# EAGLE design Hank2 (EAGLE 7.7.0)
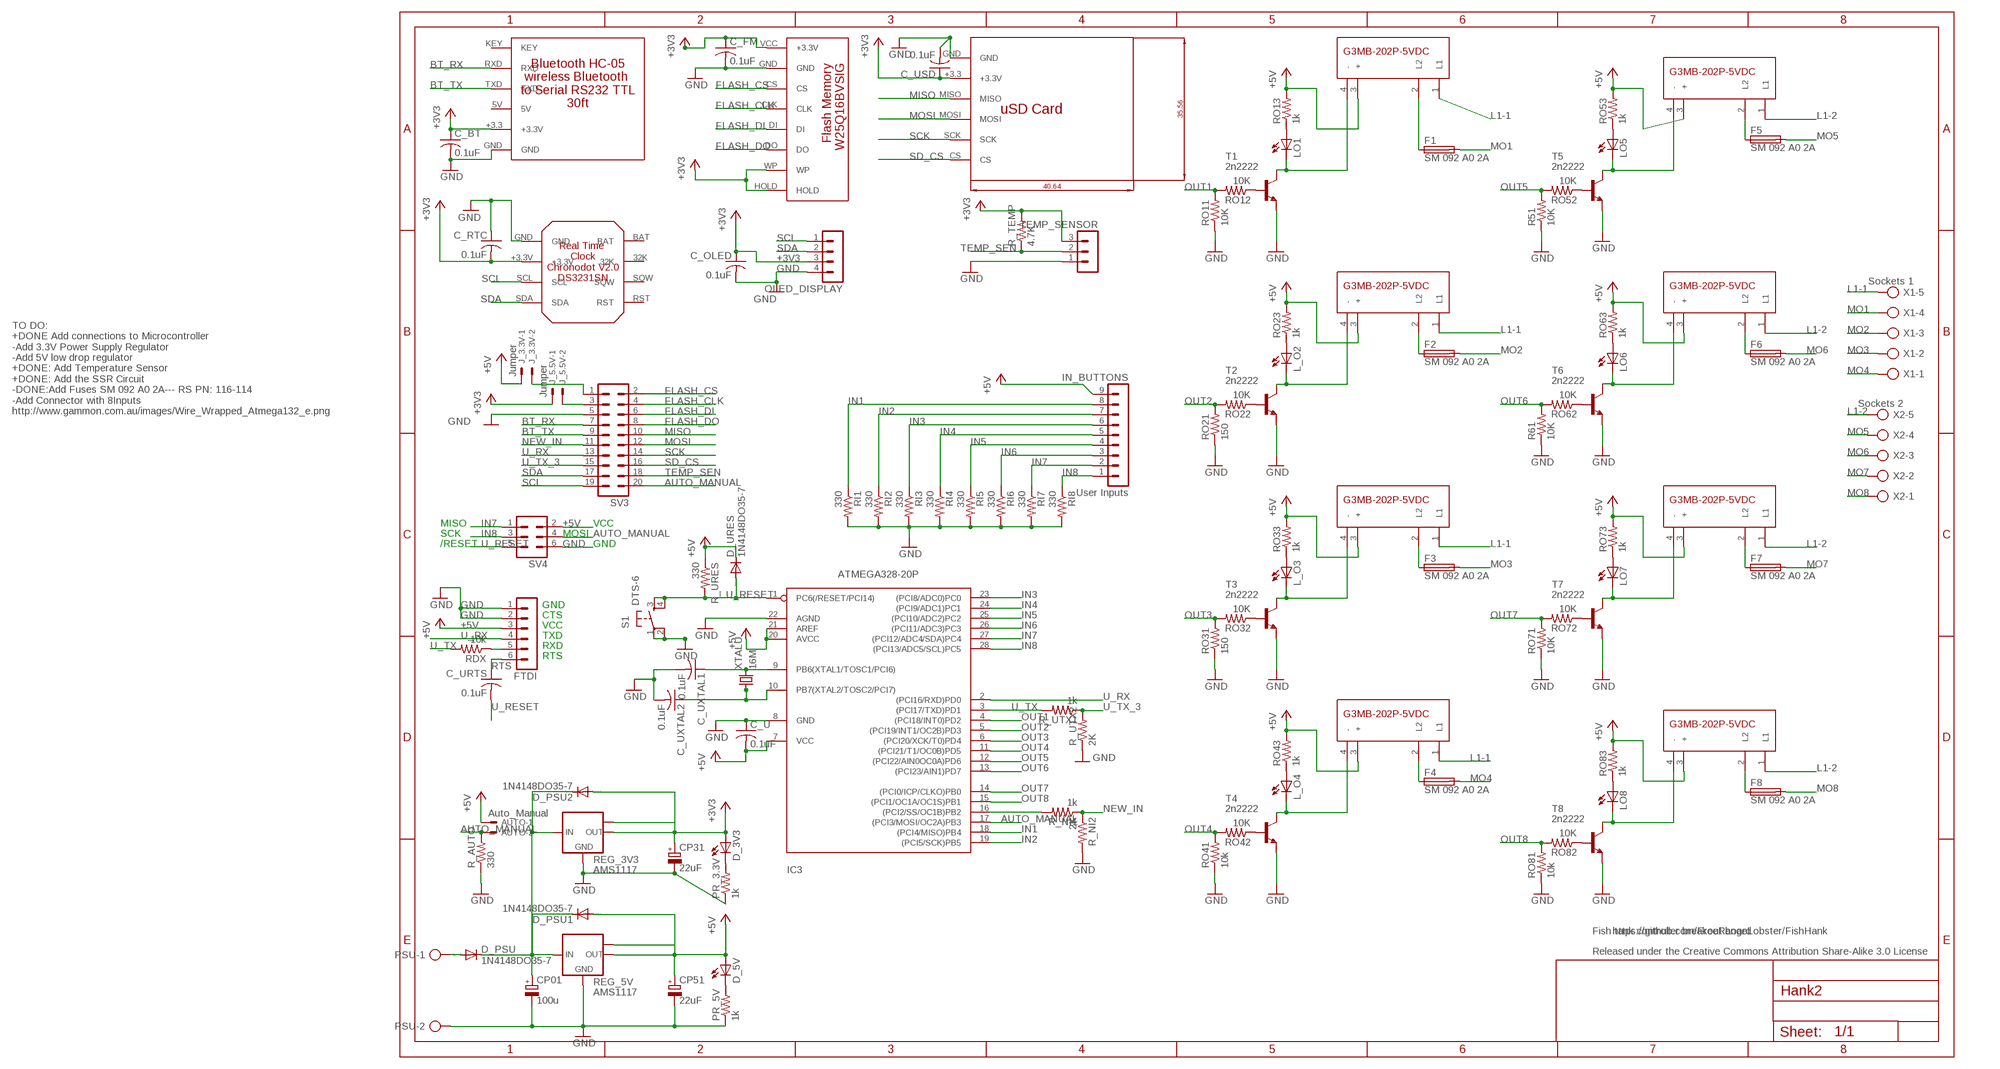
[diagram p0: schematic, sheet 1]

## Parts
AUTO  Auto_Manual  22-23-2021  [22-23-2021]
C_BT  0.1uF  C-US025-024X044  [C025-024X044]
C_FM  0.1uF  C-US025-024X044  [C025-024X044]
C_OLED  0.1uF  C-US025-024X044  [C025-024X044]
C_RTC  0.1uF  C-US025-024X044  [C025-024X044]
C_U  0.1uF  C-US025-024X044  [C025-024X044]
C_URTS  0.1uF  C-US025-024X044  [C025-024X044]
C_USD  0.1uF  C-US025-024X044  [C025-024X044]
C_UXTAL1  0.1uF  C-US025-024X044  [C025-024X044]
C_UXTAL2  0.1uF  C-US025-024X044  [C025-024X044]
CP01  100u  CPOL-EUE2.5-6  [E2,5-6]
CP31  22uF  CPOL-EUE2.5-6  [E2,5-6]
CP51  22uF  CPOL-EUE2.5-6  [E2,5-6]
D_3V3  LED3MM  [LED3MM]
D_5V  LED3MM  [LED3MM]
D_PSU  1N4148DO35-7  [DO35-7]
D_PSU1  1N4148DO35-7  [DO35-7]
D_PSU2  1N4148DO35-7  [DO35-7]
D_URES  1N4148DO35-7  [DO35-7]
F1  SM 092 A0 2A  FUSEPICOFUSE  [PICOFUSE]
F2  SM 092 A0 2A  FUSEPICOFUSE  [PICOFUSE]
F3  SM 092 A0 2A  FUSEPICOFUSE  [PICOFUSE]
F4  SM 092 A0 2A  FUSEPICOFUSE  [PICOFUSE]
F5  SM 092 A0 2A  FUSEPICOFUSE  [PICOFUSE]
F6  SM 092 A0 2A  FUSEPICOFUSE  [PICOFUSE]
F7  SM 092 A0 2A  FUSEPICOFUSE  [PICOFUSE]
F8  SM 092 A0 2A  FUSEPICOFUSE  [PICOFUSE]
FTDI  MA06-1  [MA06-1]
IC3  ATMEGA328-20P  [DIL28-3]
IN_BUTTONS  User Inputs  MA09-1  [MA09-1]
J_3.3V  Jumper  22-23-2021  [22-23-2021]
J_5.5V  Jumper  22-23-2021  [22-23-2021]
L_O2  LED3MM  [LED3MM]
L_O3  LED3MM  [LED3MM]
L_O4  LED3MM  [LED3MM]
LO1  LED3MM  [LED3MM]
LO5  LED3MM  [LED3MM]
LO6  LED3MM  [LED3MM]
LO7  LED3MM  [LED3MM]
LO8  LED3MM  [LED3MM]
OLED_DISPLAY  MA04-1  [MA04-1]
PR_3.3V  1k  R-US_0207/10  [0207/10]
PR_5V  1k  R-US_0207/10  [0207/10]
PSU  AK500/2  [AK500/2]
R51  10K  R-US_0207/10  [0207/10]
R61  10K  R-US_0207/10  [0207/10]
R_AUTO  330  R-US_0207/10  [0207/10]
R_NI1  1k  R-US_0207/10  [0207/10]
R_NI2  2K  R-US_0207/10  [0207/10]
R_TEMP  4.7K  R-US_0207/10  [0207/10]
R_URES  330  R-US_0207/10  [0207/10]
R_UTX1  1k  R-US_0207/10  [0207/10]
R_UTX2  2K  R-US_0207/10  [0207/10]
RDX  10k  R-US_0207/10  [0207/10]
REG_3V3  AMS1117  [SOT223]
REG_5V  AMS1117  [SOT223]
RI1  330  R-US_0207/10  [0207/10]
RI2  330  R-US_0207/10  [0207/10]
RI3  330  R-US_0207/10  [0207/10]
RI4  330  R-US_0207/10  [0207/10]
RI5  330  R-US_0207/10  [0207/10]
RI6  330  R-US_0207/10  [0207/10]
RI7  330  R-US_0207/10  [0207/10]
RI8  330  R-US_0207/10  [0207/10]
RO11  10K  R-US_0207/10  [0207/10]
RO12  10K  R-US_0207/10  [0207/10]
RO13  1k  R-US_0207/10  [0207/10]
RO21  150  R-US_0207/10  [0207/10]
RO22  10K  R-US_0207/10  [0207/10]
RO23  1k  R-US_0207/10  [0207/10]
RO31  150  R-US_0207/10  [0207/10]
RO32  10K  R-US_0207/10  [0207/10]
RO33  1k  R-US_0207/10  [0207/10]
RO41  10k  R-US_0207/10  [0207/10]
RO42  10K  R-US_0207/10  [0207/10]
RO43  1k  R-US_0207/10  [0207/10]
RO52  10K  R-US_0207/10  [0207/10]
RO53  1k  R-US_0207/10  [0207/10]
RO62  10K  R-US_0207/10  [0207/10]
RO63  1k  R-US_0207/10  [0207/10]
RO71  10K  R-US_0207/10  [0207/10]
RO72  10K  R-US_0207/10  [0207/10]
RO73  1k  R-US_0207/10  [0207/10]
RO81  10k  R-US_0207/10  [0207/10]
RO82  10K  R-US_0207/10  [0207/10]
RO83  1k  R-US_0207/10  [0207/10]
S1  DTS-6  [DTS-6]
SSR1  SSR  [SSR_FOOTPRINT]
SSR2  SSR  [SSR_FOOTPRINT]
SSR3  SSR  [SSR_FOOTPRINT]
SSR4  SSR  [SSR_FOOTPRINT]
SSR5  SSR  [SSR_FOOTPRINT]
SSR6  SSR  [SSR_FOOTPRINT]
SSR7  SSR  [SSR_FOOTPRINT]
SSR8  SSR  [SSR_FOOTPRINT]
SV3  MA10-2  [MA10-2]
SV4  MA03-2  [MA03-2]
T1  2n2222  2SC458  [TO92-ECB]
T2  2n2222  2SC458  [TO92-ECB]
T3  2n2222  2SC458  [TO92-ECB]
T4  2n2222  2SC458  [TO92-ECB]
T5  2n2222  2SC458  [TO92-ECB]
T6  2n2222  2SC458  [TO92-ECB]
T7  2n2222  2SC458  [TO92-ECB]
T8  2n2222  2SC458  [TO92-ECB]
TEMP_SENSOR  MA03-1  [MA03-1]
U$1  FLASH_MEMORY  [FLASHMEMORY_FOOTPRINT]
U$4  BLUETOOTH  [BLUETOOTH_FOOTPRINT]
U$6  RTC  [RTC_FOOTPRINT]
U$7  SD_CARD_READER  [SD_CARD_READER_FOOTPRINT]
X1  Sockets 1  AK500/5  [AK500/5]
X2  Sockets 2  AK500/5  [AK500/5]
XTALU  16M  CRYSTALHC49S  [HC49/S]

## Nets
+3V3: C_BT.1 C_FM.1 C_OLED.1 C_RTC.2 C_USD.1 CP31.+ D_3V3.A D_PSU2.A J_5.5V.1 OLED_DISPLAY.3 R_TEMP.2 REG_3V3.2(OUT) REG_3V3.TAB(OUT1) TEMP_SENSOR.3 U$1.HOLD U$1.VCC(+3.3V) U$1.WP U$4.+3.3(+3.3V) U$6.+3.3V U$7.+3.3(+3.3V)
+5V: AUTO.1 C_U.2 CP51.+ D_5V.A D_PSU1.A D_URES.C FTDI.3 IC3.7(VCC) IC3.20(AVCC) IC3.21(AREF) IN_BUTTONS.9 J_3.3V.1 R_URES.1 REG_5V.2(OUT) REG_5V.TAB(OUT1) RO13.2 RO23.2 RO33.2 RO43.2 RO53.2 RO63.2 RO73.2 RO83.2 SSR1.3(+) SSR2.3(+) SSR3.3(+) SSR4.3(+) SSR5.3(+) SSR6.3(+) SSR7.3(+) SSR8.3(+) SV4.2
AUTO_MANUAL: AUTO.2 IC3.17((PCI3/MOSI/OC2A)PB3) R_AUTO.2 SV3.20 SV4.4
BT_RX: SV3.7 U$4.RXD
BT_TX: SV3.9 U$4.TXD
CP12: CP01.+ D_PSU1.C D_PSU2.C D_PSU.C REG_3V3.3(IN) REG_5V.3(IN)
FLASH_CLK: SV3.4 U$1.CLK
FLASH_CS: SV3.2 U$1.CS
FLASH_DI: SV3.6 U$1.DI
FLASH_DO: SV3.8 U$1.DO
GND [vcc]: C_BT.2 C_FM.2 C_OLED.2 C_RTC.1 C_U.1 C_USD.2 C_UXTAL1.2 C_UXTAL2.2 CP01.- CP31.- CP51.- FTDI.1 FTDI.2 IC3.8(GND) IC3.22(AGND) OLED_DISPLAY.4 PR_3.3V.1 PR_5V.1 PSU.2 R51.1 R61.1 R_AUTO.1 R_NI2.2 R_UTX2.1 REG_3V3.1(GND) REG_5V.1(GND) RI1.2 RI2.2 RI3.2 RI4.2 RI5.2 RI6.2 RI7.2 RI8.2 RO11.1 RO21.1 RO31.1 RO41.1 RO71.1 RO81.1 S1.1 S1.2 SV3.5 SV4.6 T1.E T2.E T3.E T4.E T5.E T6.E T7.E T8.E TEMP_SENSOR.1 U$1.GND U$4.GND U$6.GND U$7.GND
IN1: IC3.18((PCI4/MISO)PB4) IN_BUTTONS.8 RI1.1
IN2: IC3.19((PCI5/SCK)PB5) IN_BUTTONS.7 RI2.1
IN3: IC3.23((PCI8/ADC0)PC0) IN_BUTTONS.6 RI3.1
IN4: IC3.24((PCI9/ADC1)PC1) IN_BUTTONS.5 RI4.1
IN5: IC3.25((PCI10/ADC2)PC2) IN_BUTTONS.4 RI5.1
IN6: IC3.26((PCI11/ADC3)PC3) IN_BUTTONS.3 RI6.1
IN7: IC3.27((PCI12/ADC4/SDA)PC4) IN_BUTTONS.2 RI7.1 SV4.1
IN8: IC3.28((PCI13/ADC5/SCL)PC5) IN_BUTTONS.1 RI8.1 SV4.3
L1-1: SSR1.1(L1) SSR2.1(L1) SSR3.1(L1) SSR4.1(L1) X1.5
L1-2: SSR5.1(L1) SSR6.1(L1) SSR7.1(L1) SSR8.1(L1) X2.5
L_O1: L_O2.K(C) SSR2.4(-) T2.C
L_O3: L_O3.K(C) SSR3.4(-) T3.C
MISO: SV3.10 U$7.MISO
MO1: F1.2 X1.4
MO2: F2.2 X1.3
MO3: F3.2 X1.2
MO4: F4.2 X1.1
MO5: F5.2 X2.4
MO6: F6.2 X2.3
MO7: F7.2 X2.2
MO8: F8.2 X2.1
MOSI: SV3.12 U$7.MOSI
N$1: J_3.3V.2 SV3.1
N$2: J_5.5V.2 SV3.3
N$3: F1.1 SSR1.2(L2)
N$4: D_5V.K(C) PR_5V.2
N$5: D_3V3.K(C) PR_3.3V.2
N$7: D_PSU.A PSU.1
N$8: RO12.1 T1.B
N$9: RO52.1 T5.B
N$10: F8.1 SSR8.2(L2)
N$11: LO5.A RO53.1
N$12: LO5.K(C) SSR5.4(-) T5.C
N$13: F7.1 SSR7.2(L2)
N$14: F2.1 SSR2.2(L2)
N$15: F3.1 SSR3.2(L2)
N$16: LO6.A RO63.1
N$17: LO6.K(C) SSR6.4(-) T6.C
N$18: RO62.1 T6.B
N$19: F6.1 SSR6.2(L2)
N$20: LO7.A RO73.1
N$21: LO7.K(C) SSR7.4(-) T7.C
N$22: RO72.1 T7.B
N$23: RO42.1 T4.B
N$24: F4.1 SSR4.2(L2)
N$25: LO8.A RO83.1
N$26: LO8.K(C) SSR8.4(-) T8.C
N$27: RO32.1 T3.B
N$28: F5.1 SSR5.2(L2)
N$29: LO1.A RO13.1
N$30: LO1.K(C) SSR1.4(-) T1.C
N$31: RO22.1 T2.B
N$32: C_UXTAL1.1 IC3.9(PB6(XTAL1/TOSC1/PCI6)) XTALU.2
N$33: L_O2.A RO23.1
N$34: RO82.1 T8.B
N$35: C_UXTAL2.1 IC3.10(PB7(XTAL2/TOSC2/PCI7)) XTALU.1
N$37: L_O3.A RO33.1
N$39: IC3.16((PCI2/SS/OC1B)PB2) R_NI1.2
N$41: L_O4.A RO43.1
N$42: L_O4.K(C) SSR4.4(-) T4.C
NEW_IN: R_NI1.1 R_NI2.1 SV3.11
OUT1: IC3.4((PCI18/INT0)PD2) RO11.2 RO12.2
OUT2: IC3.5((PCI19/INT1/OC2B)PD3) RO21.2 RO22.2
OUT3: IC3.6((PCI20/XCK/T0)PD4) RO31.2 RO32.2
OUT4: IC3.11((PCI21/T1/OC0B)PD5) RO41.2 RO42.2
OUT5: IC3.12((PCI22/AIN0OC0A)PD6) R51.2 RO52.2
OUT6: IC3.13((PCI23/AIN1)PD7) R61.2 RO62.2
OUT7: IC3.14((PCI0/ICP/CLKO)PB0) RO71.2 RO72.2
OUT8: IC3.15((PCI1/OC1A/OC1S)PB1) RO81.2 RO82.2
RTS: C_URTS.1 FTDI.6
SCK: SV3.14 U$7.SCK
SCL: OLED_DISPLAY.1 SV3.19 U$6.SCL
SD_CS: SV3.16 U$7.CS
SDA: OLED_DISPLAY.2 SV3.17 U$6.SDA
TEMP_SEN: R_TEMP.1 SV3.18 TEMP_SENSOR.2
U_RESET: C_URTS.2 D_URES.A IC3.1(PC6(/RESET/PCI14)) R_URES.2 S1.3 S1.4 SV4.5
U_RX: FTDI.4 IC3.2((PCI16/RXD)PD0) SV3.13
U_TX: IC3.3((PCI17/TXD)PD1) R_UTX1.2 RDX.2
U_TX_3: R_UTX1.1 R_UTX2.2 SV3.15
UTX: FTDI.5 RDX.1
Unconnected: U$4.5V U$4.KEY U$6.32K U$6.BAT U$6.RST U$6.SQW

## Notes on the sheet
- TO DO:
  +DONE Add connections to Microcontroller
  -Add 3.3V Power Supply Regulator
  -Add 5V low drop regulator
  +DONE: Add Temperature Sensor
  +DONE: Add the SSR Circuit
  -DONE:Add Fuses SM 092 A0 2A--- RS PN: 116-114
  -Add Connector with 8Inputs
  http://www.gammon.com.au/images/Wire_Wrapped_Atmega132_e.png
- MISO | VCC
- SCK | MOSI
- /RESET | GND
- GND
- CTS
- VCC
- TXD
- RXD
- RTS
- Fish tank controller breakout board | https://github.com/FreeRangeLobster/FishHank
- Released under the Creative Commons Attribution Share-Alike 3.0 License

## Library data of the parts
AUTO J_3.3V J_5.5V = con-molex:22-23-2021: .100" (2.54mm) Center Header - 2 Pin; MF: MOLEX; MPN: 22-23-2021; OC_FARNELL: 1462926; OC_NEWARK: 25C3832
C_BT C_FM C_OLED C_RTC C_U C_URTS C_USD C_UXTAL1 C_UXTAL2 = rcl:C-US: CAPACITOR, American symbol
CP01 CP31 CP51 = rcl:CPOL-EU: POLARIZED CAPACITOR, European symbol
D_3V3 D_5V L_O2-L_O4 LO1 LO5-LO8 = led:LED: LED OSRAM: - CHIPLED LG R971, LG N971, LY N971, LG Q971, LY Q971, LO R971, LY R971 LH N974, LH R974 LS Q976, LO Q976, LY Q976 LO Q996 - Hyper CHIPLED LW Q18S LB Q993, LB Q99A, LB R99A - SideLED LS A670, LO A670, LY A670, LG A670, LP A670 LB A673, LV A673, LT A673, LW A673 LH A674 LY A675 LS A676, LA A676, LO A676, LY A676, LW A676 LS A679, LY A679, LG A679 - Hyper Micro SIDELED® LS Y876, LA Y876, LO Y876, LY Y876 LT Y87S - SmartLED LW L88C, LW L88S LB L89C, LB L89S, LG L890 LS L89K, LO L89K, LY L89K LS L896, LA L896, LO L896, LY L896 - TOPLED LS T670, LO T670, LY T670, LG T670, LP T670 LSG T670, LSP T670, LSY T670, LOP T670, LYG T670 LG T671, LOG T671, LSG T671 LB T673, LV T673, LT T673, LW T673 LH T674 LS T676, LA T676, LO T676, LY T676, LB T676, LH T676, LSB T676, LW T676 LB T67C, LV T67C, LT T67C, LS T67K, LO T67K, LY T67K, LW E67C LS E67B, LA E67B, LO E67B, LY E67B, LB E67C, LV E67C, LT E67C LW T67C LS T679, LY T679, LG T679 LS T770, LO T770, LY T770, LG T770, LP T770 LB T773, LV T773, LT T773, LW T773 LH T774 LS E675, LA E675, LY E675, LS T675 LS T776, LA T776, LO T776, LY T776, LB T776 LHGB T686 LT T68C, LB T68C - Hyper Mini TOPLED® LB M676 - Mini TOPLED Santana® LG M470 LS M47K, LO M47K, LY M47K Source: http://www.osram.convergy.de LUXEON: - LUMILED® LXK2-PW12-R00, LXK2-PW12-S00, LXK2-PW14-U00, LXK2-PW14-V00 LXK2-PM12-R00, LXK2-PM12-S00, LXK2-PM14-U00 LXK2-PE12-Q00, LXK2-PE12-R00, LXK2-PE12-S00, LXK2-PE14-T00, LXK2-PE14-U00 LXK2-PB12-K00, LXK2-PB12-L00, LXK2-PB12-M00, LXK2-PB14-N00, LXK2-PB14-P00, LXK2-PB14-Q00 LXK2-PR12-L00, LXK2-PR12-M00, LXK2-PR14-Q00, LXK2-PR14-R00 LXK2-PD12-Q00, LXK2-PD12-R00, LXK2-PD12-S00 LXK2-PH12-R00, LXK2-PH12-S00 LXK2-PL12-P00, LXK2-PL12-Q00, LXK2-PL12-R00 Source: www.luxeon.com KINGBRIGHT: KA-3528ASYC Source: www.kingbright.com
D_PSU D_PSU1 D_PSU2 D_URES = diode:1N4148: DIODE high speed (Philips)
F1-F8 = fuse:FUSE: Fuse; OC_FARNELL: unknown; OC_NEWARK: unknown
FTDI = con-lstb:MA06-1: PIN HEADER; OC_FARNELL: unknown; OC_NEWARK: unknown
IC3 = atmega328:ATMEGA328*P: MICROCONTROLLER 32 kBytes FLASH 2 kBytes SRAM 1 kBytes EEPROM USART 8-channel 10 bit ADC
IN_BUTTONS = con-lstb:MA09-1: PIN HEADER; OC_FARNELL: unknown; OC_NEWARK: unknown
OLED_DISPLAY = con-lstb:MA04-1: PIN HEADER; OC_FARNELL: unknown; OC_NEWARK: unknown
PR_3.3V PR_5V R51 R61 R_AUTO R_NI1 R_NI2 R_TEMP R_URES R_UTX1 R_UTX2 RDX RI1-RI8 RO11-RO13 RO21-RO23 RO31-RO33 RO41-RO43 RO52 RO53 RO62 RO63 RO71-RO73 RO81-RO83 = rcl:R-US_: RESISTOR, American symbol
PSU = con-ptr500:AK500/2: CONNECTOR; OC_FARNELL: unknown; OC_NEWARK: unknown
REG_3V3 REG_5V = AMS117:AMS1117
S1 = switch-tact:DTS-6
SSR1-SSR8 = HankLibraries:SSR
SV3 = con-lstb:MA10-2: PIN HEADER; OC_FARNELL: unknown; OC_NEWARK: unknown
SV4 = con-lstb:MA03-2: PIN HEADER; OC_FARNELL: unknown; OC_NEWARK: unknown
T1-T8 = transistor:2SC458: NPN Silicon Epitaxial Planar Transistor Source: SEMTECH ELECTRONICS LTD. ... 2SC458 1.pdf
TEMP_SENSOR = con-lstb:MA03-1: PIN HEADER; OC_FARNELL: unknown; OC_NEWARK: unknown
U$1 = HankLibraries:FLASH_MEMORY
U$4 = HankLibraries:BLUETOOTH
U$6 = HankLibraries:RTC: Real Time Clock PCB Using DS3231SN. Developed by JVivas
U$7 = HankLibraries:SD_CARD_READER
X1 X2 = con-ptr500:AK500/5: CONNECTOR; OC_FARNELL: unknown; OC_NEWARK: unknown
XTALU = crystal:CRYSTAL: CRYSTAL; OC_FARNELL: 1667008; OC_NEWARK: unknown

## Net classes
1 vcc: width 0.508 mm

## Board
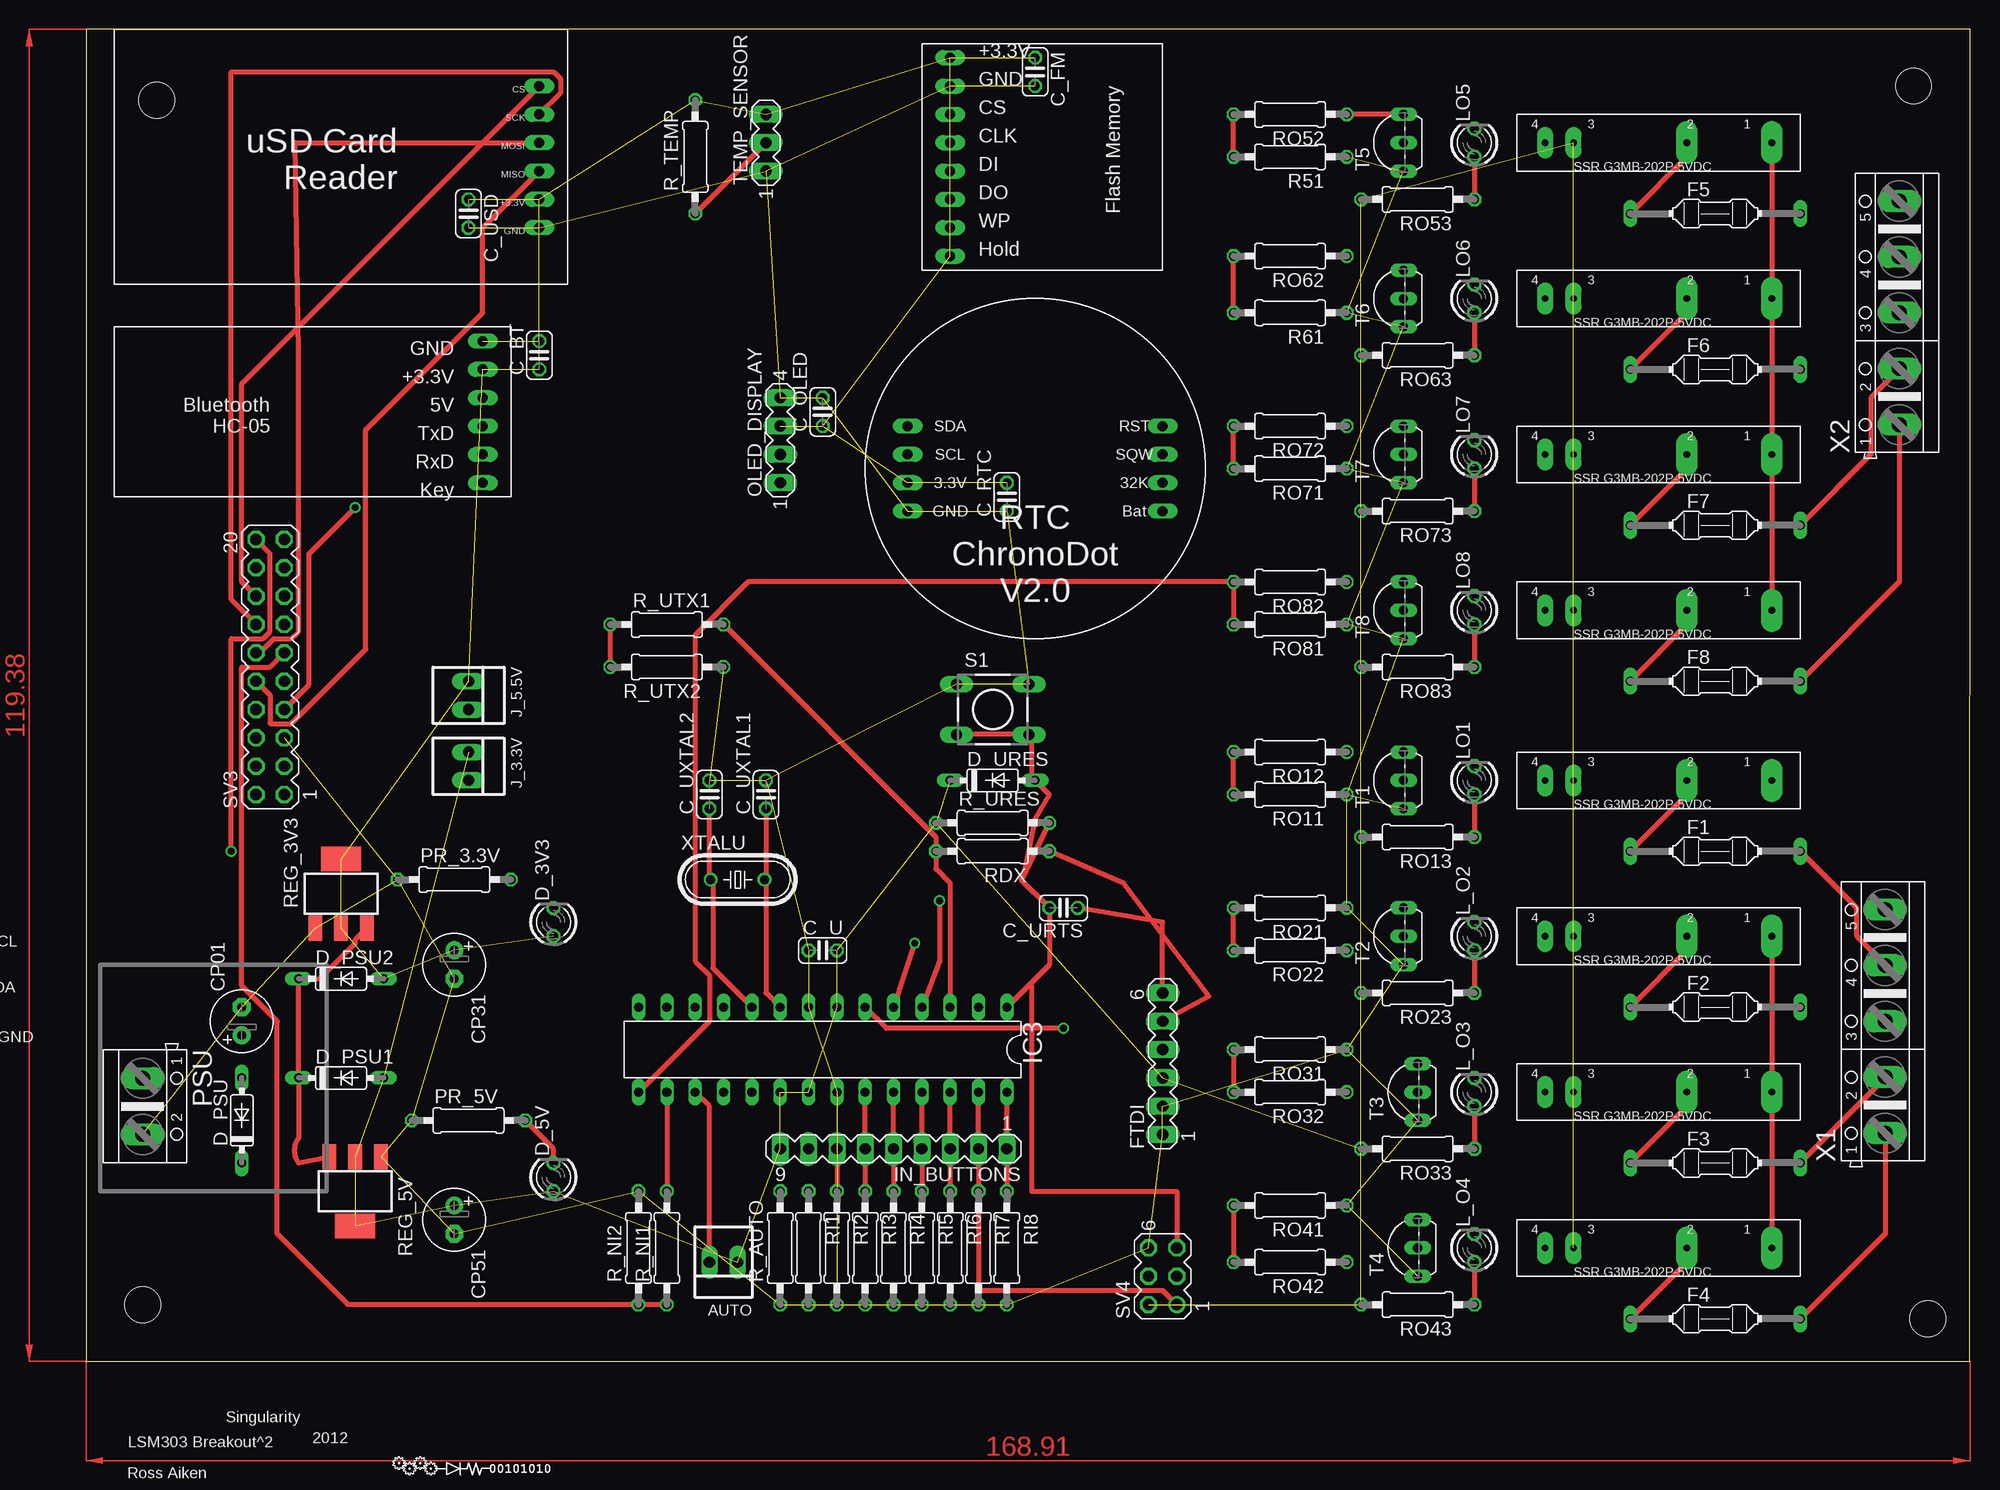
[diagram p1: board, top side]
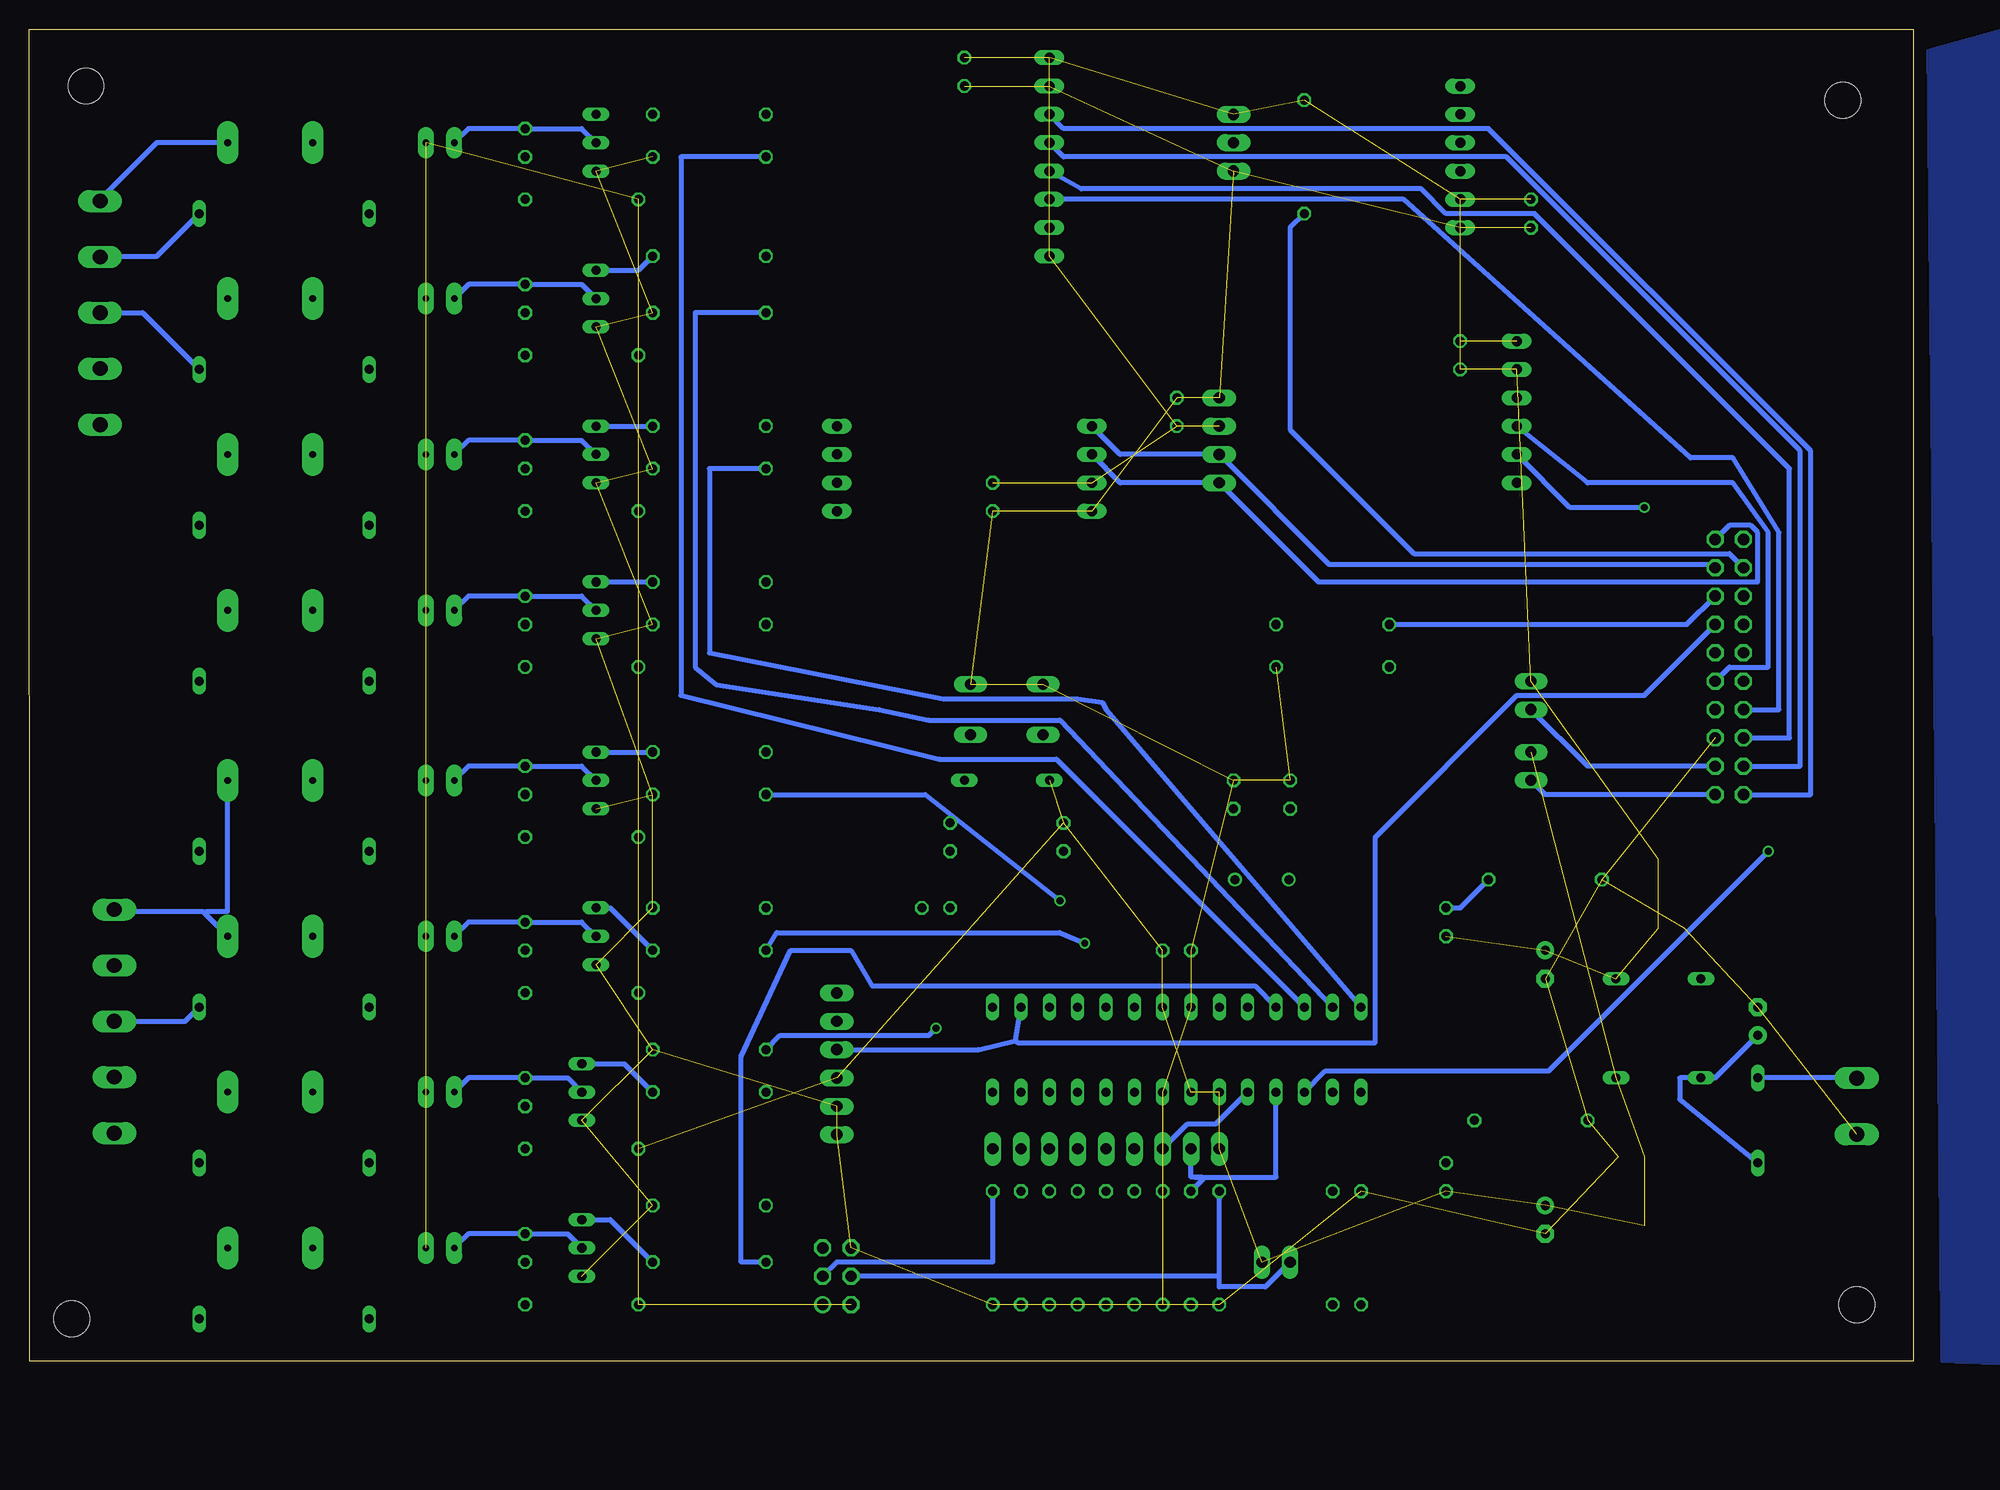
[diagram p2: board, bottom side, seen from below]

Size 168.91 x 119.38 mm. Coordinates in mm from the lower left corner, seen from the top.
Outline: 0,0 168.89,0 168.91,119.38 0,119.38 0,0
Copper layers (1*16): Top 0.0356mm / dielectric 1.5011mm / Bottom 0.0356mm
Design rules "default *": minimum track width 18mil, minimum drill 24mil, track to track 8mil, track to pad 8mil, pad to pad 8mil, via to via 8mil, smd to smd 0mil, copper to edge 40mil, drill to drill 8mil, minimum pad ring 7mil, minimum via ring 7mil, stop-mask expansion 4mil, vias tented up to drill 0mil, thermal gap 10mil
Holes 3.2 mm at 5.08,5.08 6.35,113.03 163.83,114.3 165.1,3.81

### Footprints (pad centres in the part's own frame; a part is rotated, then mirrored left to right if it is on the bottom)
22-23-2021 = drill 1 long: 1 -1.27,0; 2 1.27,0
C025-024X044 = drill 0.813 octagon: 1 -1.27,0; 2 1.27,0
E2,5-6 = drill 0.813 pad 1.6: + -1.27,0 | drill 0.813 pad 1.6 octagon: - 1.27,0
LED3MM = drill 0.813 octagon: A -1.27,0; K 1.27,0
DO35-7 = drill 0.813 long: A 3.81,0; C -3.81,0
PICOFUSE = drill 0.813 long: 1 -7.62,0; 2 7.62,0
MA06-1 = drill 1.016 long: 1 -6.35,0; 2 -3.81,0; 3 -1.27,0; 4 1.27,0; 5 3.81,0; 6 6.35,0
DIL28-3 = drill 0.813 long: 1 -16.51,-3.81; 2 -13.97,-3.81; 3 -11.43,-3.81; 4 -8.89,-3.81; 5 -6.35,-3.81; 6 -3.81,-3.81; 7 -1.27,-3.81; 8 1.27,-3.81; 9 3.81,-3.81; 10 6.35,-3.81; 11 8.89,-3.81; 12 11.43,-3.81; 13 13.97,-3.81; 14 16.51,-3.81; 15 16.51,3.81; 16 13.97,3.81; 17 11.43,3.81; 18 8.89,3.81; 19 6.35,3.81; 20 3.81,3.81; 21 1.27,3.81; 22 -1.27,3.81; 23 -3.81,3.81; 24 -6.35,3.81; 25 -8.89,3.81; 26 -11.43,3.81; 27 -13.97,3.81; 28 -16.51,3.81
MA09-1 = drill 1.016 long: 1 -10.16,0; 2 -7.62,0; 3 -5.08,0; 4 -2.54,0; 5 0,0; 6 2.54,0; 7 5.08,0; 8 7.62,0; 9 10.16,0
MA04-1 = drill 1.016 long: 1 -3.81,0; 2 -1.27,0; 3 1.27,0; 4 3.81,0
0207/10 = drill 0.813 octagon: 1 -5.08,0; 2 5.08,0
AK500/2 = drill 1.321 long: 1 -2.515,0; 2 2.515,0
SOT223 = smd 1.219 x 2.235: 1 -2.311,-3.099; 2 0,-3.099; 3 2.311,-3.099 | smd 3.6 x 2.2: TAB 0,3.099
DTS-6 = drill 1 long: 1 -3.25,2.25; 2 3.25,2.25; 3 -3.25,-2.25; 4 3.25,-2.25
SSR_FOOTPRINT = drill 0.6 pad 1.93 long: 1 10.16,0; 2 2.54,0 | drill 0.6 pad 1.422 long: 3 -7.62,0; 4 -10.16,0
MA10-2 = drill 1.016 octagon: 1 -11.43,-1.27; 2 -11.43,1.27; 3 -8.89,-1.27; 4 -8.89,1.27; 5 -6.35,-1.27; 6 -6.35,1.27; 7 -3.81,-1.27; 8 -3.81,1.27; 9 -1.27,-1.27; 10 -1.27,1.27; 11 1.27,-1.27; 12 1.27,1.27; 13 3.81,-1.27; 14 3.81,1.27; 15 6.35,-1.27; 16 6.35,1.27; 17 8.89,-1.27; 18 8.89,1.27; 19 11.43,-1.27; 20 11.43,1.27
MA03-2 = drill 1.016: 1 -2.54,-1.27 | drill 1.016 octagon: 2 -2.54,1.27; 3 0,-1.27; 4 0,1.27; 5 2.54,-1.27; 6 2.54,1.27
TO92-ECB = drill 0.813 long: B 2.54,0; C 0,0; E -2.54,0
MA03-1 = drill 1.016 long: 1 -2.54,0; 2 0,0; 3 2.54,0
FLASHMEMORY_FOOTPRINT = drill 0.9 long: CLK -8.89,1.27; CS -8.89,3.81; DI -8.89,-1.27; DO -8.89,-3.81; GND -8.89,6.35; HOLD -8.89,-8.89; VCC -8.89,8.89; WP -8.89,-6.35
BLUETOOTH_FOOTPRINT = drill 0.9 long: 5V -15.24,-1.27; +3.3 -15.24,-3.81; GND -15.24,-6.35; KEY -15.24,6.35; RXD -15.24,3.81; TXD -15.24,1.27
RTC_FOOTPRINT = drill 0.9 long: 32K -11.43,0; +3.3V 11.43,0; BAT -11.43,2.54; GND 11.43,2.54; RST -11.43,-5.08; SCL 11.43,-2.54; SDA 11.43,-5.08; SQW -11.43,-2.54
SD_CARD_READER_FOOTPRINT = drill 0.9 long: +3.3 -17.78,3.81; CS -17.78,-6.35; GND -17.78,6.35; MISO -17.78,1.27; MOSI -17.78,-1.27; SCK -17.78,-3.81
AK500/5 = drill 1.321 long: 1 -10.033,0; 2 -5.004,0; 3 0,0; 4 5.004,0; 5 10.008,0
HC49/S = drill 0.813: 1 -2.413,0; 2 2.413,0

### Placement (x,y rotation side)
AUTO  57.15,8.89 180 top
C_BT  40.64,90.17 90 top
C_FM  85.09,115.57 270 top
C_OLED  66.04,85.09 90 top
C_RTC  82.55,77.47 90 top
C_U  66.04,36.83 0 top
C_URTS  87.63,40.64 180 top
C_USD  34.29,102.87 270 top
C_UXTAL1  60.96,50.8 90 top
C_UXTAL2  55.88,50.8 90 top
CP01  13.97,30.48 90 top
CP31  33.02,35.56 270 top
CP51  33.02,12.7 270 top
D_3V3  41.91,39.37 90 top
D_5V  41.91,16.51 90 top
D_PSU  13.97,21.59 90 top
D_PSU1  22.86,25.4 0 top
D_PSU2  22.86,34.29 0 top
D_URES  81.28,52.07 0 top
F1  146.05,45.72 0 top
F2  146.05,31.75 0 top
F3  146.05,17.78 0 top
F4  146.05,3.81 0 top
F5  146.05,102.87 0 top
F6  146.05,88.9 0 top
F7  146.05,74.93 0 top
F8  146.05,60.96 0 top
FTDI  96.52,26.67 90 top
IC3  66.04,27.94 180 top
IN_BUTTONS  72.39,19.05 180 top
J_3.3V  34.29,53.34 270 top
J_5.5V  34.29,59.69 270 top
L_O2  124.46,38.1 90 top
L_O3  124.46,24.13 90 top
L_O4  124.46,10.16 90 top
LO1  124.46,52.07 90 top
LO5  124.46,109.22 90 top
LO6  124.46,95.25 90 top
LO7  124.46,81.28 90 top
LO8  124.46,67.31 90 top
OLED_DISPLAY  62.23,82.55 90 top
PR_3.3V  33.02,43.18 0 top
PR_5V  34.29,21.59 0 top
PSU  5.08,22.86 270 top
R51  107.95,107.95 180 top
R61  107.95,93.98 180 top
R_AUTO  62.23,10.16 90 top
R_NI1  52.07,10.16 90 top
R_NI2  49.53,10.16 90 top
R_TEMP  54.61,107.95 90 top
R_URES  81.28,48.26 0 top
R_UTX1  52.07,66.04 0 top
R_UTX2  52.07,62.23 180 top
RDX  81.28,45.72 180 top
REG_3V3  22.86,41.91 0 top
REG_5V  24.13,15.24 180 top
RI1  64.77,10.16 270 top
RI2  67.31,10.16 270 top
RI3  69.85,10.16 270 top
RI4  72.39,10.16 270 top
RI5  74.93,10.16 270 top
RI6  77.47,10.16 270 top
RI7  80.01,10.16 270 top
RI8  82.55,10.16 270 top
RO11  107.95,50.8 180 top
RO12  107.95,54.61 180 top
RO13  119.38,46.99 180 top
RO21  107.95,40.64 180 top
RO22  107.95,36.83 180 top
RO23  119.38,33.02 180 top
RO31  107.95,27.94 180 top
RO32  107.95,24.13 180 top
RO33  119.38,19.05 180 top
RO41  107.95,13.97 180 top
RO42  107.95,8.89 180 top
RO43  119.38,5.08 180 top
RO52  107.95,111.76 180 top
RO53  119.38,104.14 180 top
RO62  107.95,99.06 180 top
RO63  119.38,90.17 180 top
RO71  107.95,80.01 180 top
RO72  107.95,83.82 180 top
RO73  119.38,76.2 180 top
RO81  107.95,66.04 180 top
RO82  107.95,69.85 180 top
RO83  119.38,62.23 180 top
S1  81.28,58.42 0 top
SSR1  140.97,52.07 0 top
SSR2  140.97,38.1 0 top
SSR3  140.97,24.13 0 top
SSR4  140.97,10.16 0 top
SSR5  140.97,109.22 0 top
SSR6  140.97,95.25 0 top
SSR7  140.97,81.28 0 top
SSR8  140.97,67.31 0 top
SV3  16.51,62.23 90 top
SV4  96.52,7.62 90 top
T1  118.11,52.07 90 top
T2  118.11,38.1 90 top
T3  119.38,24.13 90 top
T4  119.38,10.16 90 top
T5  118.11,109.22 90 top
T6  118.11,95.25 90 top
T7  118.11,81.28 90 top
T8  118.11,67.31 90 top
TEMP_SENSOR  60.96,109.22 90 top
U$1  86.36,107.95 0 top
U$4  20.32,85.09 180 top
U$6  85.09,78.74 180 top
U$7  22.86,107.95 180 top
X1  161.29,30.48 90 top
X2  162.56,93.98 90 top
XTALU  58.42,43.18 0 top

### Tracks (layer width: path | path; a pad name or v marks a point on that pad's centre or on a via)
+3V3  (19 unrouted)
+5V  (31 unrouted)
AUTO_MANUAL  (via drill 0.61)
  Top 0.457: IC3.17 55.88,22.86 AUTO.2 | SV3.20 16.51,72.39 16.51,65.41 15.88,64.77 13.02,64.77 v13.02,45.72
  Bottom 0.457: 62.23,7.62 62.23,6.67 58.1,6.67 AUTO.2 | 62.23,7.62 R_AUTO.2 | v13.02,45.72 32.7,26.04 52.7,26.04 IC3.17 | 62.23,7.62 SV4.4
BT_RX  (via drill 0.61)
  Top 0.457: v24.13,76.52 20,72.39 20,60.64 SV3.7
  Bottom 0.457: U$4.RXD 30.8,76.52 v24.13,76.52
BT_TX
  Bottom 0.457: U$4.TXD 29.21,78.74 16.19,78.74 13.02,74.3 13.02,62.23 16.51,62.23 SV3.9
CP12
  Top 0.457: REG_3V3.3 25.08,38.73 24.13,37.78 24.13,37.47 20.95,34.29 D_PSU2.C D_PSU1.C 19.05,20 arc74 19.05,17.78 REG_5V.3
  Bottom 0.457: D_PSU.C 20.95,23.5 20.95,25.4 D_PSU1.C 17.78,25.4 CP01.+
FLASH_CLK
  Bottom 0.457: U$1.CLK 76.2,107.95 36.51,107.95 10.16,81.6 10.16,53.34 SV3.4
FLASH_CS
  Bottom 0.457: U$1.CS 76.2,110.49 38.1,110.49 9.21,81.6 9.21,50.8 SV3.2
FLASH_DI
  Bottom 0.457: U$1.DI 74.61,105.09 44.13,105.09 41.91,102.87 33.97,102.87 11.11,80.01 11.11,55.88 SV3.6
FLASH_DO
  Bottom 0.457: U$1.DO 45.72,104.14 20,80.96 16.19,80.96 12.06,74.3 12.06,58.42 SV3.8
GND  (56 unrouted)
  pour Bottom (isolate 0.152): -8.26,119.38 -1.27,117.47 -2.54,0 -8.41,-0.22
IN1
  Bottom 0.457: IC3.18 57.15,16.51 63.82,16.51 | RI1.1 63.66,16.35 | 63.66,16.35 64.77,16.51 | 64.77,16.51 IN_BUTTONS.8 | 63.82,16.51 64.77,16.51 | 63.82,16.51 63.66,16.35
IN2
  Top 0.457: IN_BUTTONS.7 RI2.1
  Bottom 0.457: IC3.19 62.55,21.27 65.09,21.27 IN_BUTTONS.7
IN3
  Top 0.457: RI3.1 IN_BUTTONS.6 IC3.23
IN4
  Top 0.457: RI4.1 IN_BUTTONS.5 IC3.24
IN5
  Top 0.457: RI5.1 IN_BUTTONS.4 IC3.25
IN6
  Top 0.457: RI6.1 IN_BUTTONS.3 IC3.26
IN7
  Top 0.457: IC3.27 IN_BUTTONS.2 RI7.1 80.01,6.35 96.52,6.35 SV4.1
IN8
  Top 0.457: RI8.1 IN_BUTTONS.1 IC3.28
  Bottom 0.457: SV4.3 96.52,8.89 82.55,8.89 RI8.1
L1-1
  Top 0.457: SSR4.1 SSR3.1 SSR2.1
  Bottom 0.457: 153.19,40.16 153.35,40.32 161.29,40.32 X1.5 | 153.19,40.16 SSR2.1 | SSR1.1 151.13,40.32 153.03,40.32 153.19,40.16
L1-2
  Top 0.457: SSR8.1 SSR7.1 SSR6.1 SSR5.1
  Bottom 0.457: SSR5.1 157.48,109.22 162.56,104.14 X2.5
L_O1
  Bottom 0.457: T2.C 119.38,39.37 L_O2.K 129.54,39.37 SSR2.4
L_O3
  Bottom 0.457: T3.C 120.65,25.4 L_O3.K 129.54,25.4 SSR3.4
MISO
  Top 0.457: U$7.MISO 35.56,101.6 35.56,93.98 25.08,83.5 25.08,63.82 18.41,57.15 16.51,57.15 16.51,59.69 SV3.10
MO1
  Top 0.457: F1.2 158.75,40.64 158.75,38.1 161.29,35.56 X1.4
MO2
  Bottom 0.457: F2.2 154.94,30.48 X1.3
MO3
  Top 0.457: F3.2 161.29,25.4 X1.2
MO4
  Top 0.457: F4.2 161.29,11.43 X1.1
MO5
  Bottom 0.457: F5.2 157.48,99.06 162.56,99.06 X2.4
MO6
  Bottom 0.457: F6.2 158.75,93.98 X2.3
MO7
  Top 0.457: F7.2 160.02,81.28 160.02,86.36 162.56,88.9 X2.2
MO8
  Top 0.457: F8.2 162.56,69.85 X2.1
MOSI
  Top 0.457: U$7.MOSI 18.73,109.22 19.05,90.49 19.05,65.41 18.41,64.77 16.83,64.77 15.56,63.5 SV3.12
N$1
  Bottom 0.457: J_3.3V.2 33.02,50.8 SV3.1
N$2
  Bottom 0.457: J_5.5V.2 29.21,53.34 SV3.3
N$3
  Top 0.457: F1.1 143.51,50.8 SSR1.2
N$4
  Top 0.457: PR_5V.2 41.91,19.05 D_5V.K
N$5
  Bottom 0.457: PR_3.3V.2 40.64,40.64 D_3V3.K
N$7
  Bottom 0.457: D_PSU.A 5.08,25.4 PSU.1
N$8
  Bottom 0.457: T1.B RO12.1
N$9
  Top 0.457: T5.B RO52.1
N$10
  Top 0.457: F8.1 143.51,66.04 SSR8.2
N$11
  Top 0.457: LO5.A RO53.1
N$12
  Bottom 0.457: T5.C 119.38,110.49 LO5.K 129.54,110.49 SSR5.4
N$13
  Top 0.457: F7.1 143.51,80.01 SSR7.2
N$14
  Top 0.457: F2.1 143.51,36.83 SSR2.2
N$15
  Top 0.457: F3.1 143.51,22.86 SSR3.2
N$16
  Top 0.457: LO6.A RO63.1
N$17
  Bottom 0.457: T6.C 119.38,96.52 LO6.K 129.54,96.52 SSR6.4
N$18
  Bottom 0.457: RO62.1 114.3,97.79 T6.B
N$19
  Top 0.457: F6.1 143.51,93.98 SSR6.2
N$20
  Top 0.457: LO7.A RO73.1
N$21
  Bottom 0.457: T7.C 119.38,82.55 LO7.K 129.54,82.55 SSR7.4
N$22
  Bottom 0.457: T7.B RO72.1
N$23
  Bottom 0.457: RO42.1 116.84,12.7 T4.B
N$24
  Top 0.457: F4.1 143.51,8.89 SSR4.2
N$25
  Top 0.457: LO8.A RO83.1
N$26
  Bottom 0.457: T8.C 119.38,68.58 LO8.K 129.54,68.58 SSR8.4
N$27
  Bottom 0.457: RO32.1 115.57,26.67 T3.B
N$28
  Top 0.457: F5.1 143.51,107.95 SSR5.2
N$29
  Top 0.457: LO1.A RO13.1
N$30
  Bottom 0.457: T1.C 119.38,53.34 LO1.K 129.54,53.34 SSR1.4
N$31
  Bottom 0.457: RO22.1 116.84,40.64 T2.B
N$32
  Top 0.457: C_UXTAL1.1 60.96,43.18 | IC3.9 60.96,33.02 60.96,43.18 | 60.96,43.18 XTALU.2
N$33
  Top 0.457: L_O2.A RO23.1
N$34
  Bottom 0.457: T8.B RO82.1
N$35
  Top 0.457: C_UXTAL2.1 55.88,43.18 XTALU.1 56.2,43.18 56.2,35.24 IC3.10
N$37
  Top 0.457: L_O3.A RO33.1
N$39
  Top 0.457: IC3.16 R_NI1.2
N$41
  Top 0.457: L_O4.A RO43.1
N$42
  Bottom 0.457: T4.C 120.65,11.43 L_O4.K 129.54,11.43 SSR4.4
NEW_IN
  Top 0.457: R_NI1.1 R_NI2.1 23.5,5.08 17.14,11.43 17.14,30.48 13.97,33.66 13.97,62.23 16.51,62.23 SV3.11
OUT1  (via drill 0.61)
  Top 0.457: IC3.4 76.52,35.88 v76.52,41.27 | RO11.2 RO12.2
  Bottom 0.457: v76.52,41.27 88.58,50.8 RO11.2
OUT2  (via drill 0.61)
  Top 0.457: v74.3,37.47 IC3.5 | RO22.2 RO21.2
  Bottom 0.457: v74.3,37.47 76.52,38.42 101.92,38.42 RO22.2
OUT3  (via drill 0.61)
  Top 0.457: RO31.2 RO32.2 | IC3.6 71.75,29.84 v87.63,29.84
  Bottom 0.457: v87.63,29.84 88.27,29.21 101.6,29.21 RO31.2
OUT4
  Top 0.457: RO41.2 RO42.2
  Bottom 0.457: IC3.11 59.05,33.66 93.34,33.66 95.25,36.83 100.65,36.83 105.09,27.3 105.09,8.89 RO42.2
OUT5
  Top 0.457: R51.2 RO52.2
  Bottom 0.457: IC3.12 76.83,53.98 87.31,53.98 110.49,59.69 110.49,107.95 R51.2
OUT6
  Top 0.457: R61.2 RO62.2
  Bottom 0.457: IC3.13 76.52,57.47 88.27,57.47 92.71,58.42 107.31,60.64 109.22,62.23 109.22,93.98 R61.2
OUT7
  Top 0.457: RO71.2 RO72.2
  Bottom 0.457: IC3.14 72.39,58.42 72.71,59.05 74.93,59.37 87,59.37 107.95,63.5 107.95,80.01 RO71.2
OUT8
  Top 0.457: IC3.15 55.88,30.48 55.88,34.61 54.61,35.88 54.61,65.09 59.37,69.85 RO82.2 RO81.2
RTS
  Top 0.457: C_URTS.1 96.52,39.37 FTDI.6
SCK
  Top 0.457: U$7.SCK 42.55,113.67 42.55,114.94 41.91,115.57 13.02,115.57 13.02,68.26 SV3.14
SCL
  Bottom 0.457: U$6.SCL 71.12,78.74 OLED_DISPLAY.1 53.34,69.85 13.97,69.85 13.97,74.3 14.61,74.93 16.51,74.93 SV3.19
SD_CS
  Top 0.457: U$7.CS 13.97,87.63 13.97,69.85 SV3.16
SDA
  Bottom 0.457: U$6.SDA 71.12,81.28 OLED_DISPLAY.2 52.39,71.44 18.1,71.44 SV3.17
TEMP_SEN
  Top 0.457: TEMP_SENSOR.2 R_TEMP.1
  Bottom 0.457: SV3.18 16.51,72.39 44.77,72.39 55.88,83.5 55.88,101.6 R_TEMP.1
U_RESET
  Top 0.457: S1.3 78.11,56.2 84.45,56.2 S1.4 84.77,55.88 84.77,52.39 D_URES.A 86.36,50.8 85.09,48.58 83.98,43.34 | 84.61,33.81 86.36,35.56 C_URTS.2 83.82,43.18 83.98,43.34 | 84.61,33.81 IC3.1 | 83.98,43.34 R_URES.2 | SV4.5 97.79,15.24 84.77,15.24 84.77,33.66 84.61,33.81
U_RX
  Bottom 0.457: 80.49,28.73 83.82,27.94 FTDI.4 | 80.49,28.73 IC3.2 | SV3.13 24.13,59.69 35.56,59.69 48.26,46.99 48.26,28.57 80.33,28.57 80.49,28.73
U_TX
  Top 0.457: IC3.3 77.47,42.86 76.2,44.13 RDX.2 76.2,46.99 R_UTX1.2
U_TX_3
  Top 0.457: R_UTX1.1 R_UTX2.2
  Bottom 0.457: SV3.15 20.32,66.04 R_UTX1.1
UTX
  Top 0.457: RDX.1 93.03,42.86 100.65,32.7 FTDI.5
(copper drawn outside any net)
  shapes: Top area x2

### Text on the board
tNames: INT1 | INT2 | out | +5V | SA | DRDY | E:/Users/Ross/Desktop/Logo_nocolor.bmp | E:/Users/Ross/Desktop/Logo_nocolor.bmp | SCL | SDA | GND | Singularity | 2012 | LSM303 Breakout^2 | Ross Aiken